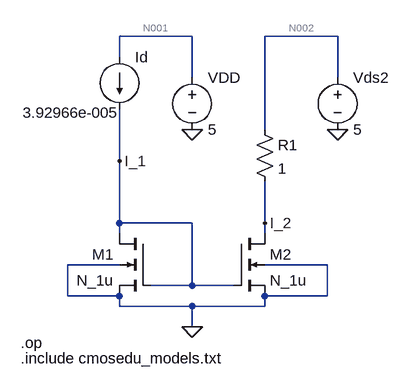
[diagram p0: schematic Parte 7.asc]
Parte 7.asc, the LTspice schematic file:
Version 4
SHEET 1 880 680
WIRE -32 -192 -144 -192
WIRE 192 -192 80 -192
WIRE -144 -160 -144 -192
WIRE -32 -128 -32 -192
WIRE 192 -128 192 -192
WIRE 80 -48 80 -192
WIRE -144 0 -144 -80
WIRE -144 96 -144 0
WIRE -32 96 -144 96
WIRE 80 96 80 32
WIRE -144 112 -144 96
WIRE 80 112 80 96
WIRE -144 160 -224 160
WIRE 176 160 80 160
WIRE -32 192 -32 96
WIRE -32 192 -96 192
WIRE 32 192 -32 192
WIRE -224 208 -224 160
WIRE -144 208 -224 208
WIRE 176 208 176 160
WIRE 176 208 80 208
WIRE -144 224 -144 208
WIRE -32 224 -144 224
WIRE 80 224 80 208
WIRE 80 224 -32 224
WIRE -32 256 -32 224
FLAG -32 256 0
FLAG -32 -48 0
FLAG -144 0 I_1
FLAG 80 96 I_2
FLAG 192 -48 0
SYMBOL nmos4 32 112 R0
SYMATTR InstName M2
SYMATTR Value N_1u
SYMATTR Value2 l=1.5u w=6u
SYMBOL nmos4 -96 112 M0
SYMATTR InstName M1
SYMATTR Value N_1u
SYMATTR Value2 l=1.5u w=3u
SYMBOL current -144 -160 R0
WINDOW 3 -149 86 Left 2
WINDOW 123 0 0 Left 2
WINDOW 39 0 0 Left 2
SYMATTR Value 3.92966e-005
SYMATTR InstName Id
SYMBOL voltage -32 -144 R0
WINDOW 123 0 0 Left 2
WINDOW 39 0 0 Left 2
SYMATTR InstName VDD
SYMATTR Value 5
SYMBOL voltage 192 -144 R0
WINDOW 123 0 0 Left 2
WINDOW 39 0 0 Left 2
SYMATTR InstName Vds2
SYMATTR Value 5
SYMBOL res 64 -64 R0
SYMATTR InstName R1
SYMATTR Value 1
TEXT -296 280 Left 2 !.op
TEXT -296 304 Left 2 !.include cmosedu_models.txt

The netlist it stands for:
* Parte 7.asc
M2 I_2 I_1 0 0 N_1u l=1.5u w=6u
M1 I_1 I_1 0 0 N_1u l=1.5u w=3u
Id N001 I_1 3.92966e-005
VDD N001 0 5
Vds2 N002 0 5
R1 N002 I_2 1
.model NMOS NMOS
.model PMOS PMOS
.lib standard.mos
.op
.include cmosedu_models.txt
.backanno
.end

* Results of the author's LTspice run, read from the files saved beside the schematic
* Operating Point:
*   V(i_2) = 5 V
*   V(i_1) = 1.5 V
*   V(n001) = 5 V
*   V(n002) = 5 V
*   Id(M1) = 39.3 µA
*   Ig(M1) = 0 A
*   Ib(M1) = -1.51 pA
*   Is(M1) = -39.3 µA
*   Id(M2) = 93.37 µA
*   Ig(M2) = 0 A
*   Ib(M2) = -5.01 pA
*   Is(M2) = -93.37 µA
*   I(Id) = 39.3 µA
*   I(R1) = 93.37 µA
*   I(Vds2) = -93.37 µA
*   I(Vdd) = -39.3 µA
* From the log:
*   Semiconductor Device Operating Points:
*                           --- MOSFET Transistors ---
*   Name:          m1          m2
*   Model:        n_1u        n_1u
*   Id:          3.93e-05    9.34e-05
*   Vgs:         1.50e+00    1.50e+00
*   Vds:         1.50e+00    5.00e+00
*   Vbs:         0.00e+00    0.00e+00
*   Vth:         8.90e-01    8.57e-01
*   Vdsat:       4.74e-01    5.11e-01
*   Gm:          1.01e-04    2.28e-04
*   Gds:         4.28e-06    9.57e-06
*   Gmb:         3.45e-05    6.60e-05
*   Cbd:         0.00e+00    0.00e+00
*   Cbs:         0.00e+00    0.00e+00
*   Cgsov:       6.00e-16    1.20e-15
*   Cgdov:       6.00e-16    1.20e-15
*   Cgbov:       1.30e-16    1.30e-16
*   Cgs:         4.49e-15    8.98e-15
*   Cgd:         0.00e+00    0.00e+00
*   Cgb:         0.00e+00    0.00e+00